# EAGLE schematic Esquematico_reservatorio (EAGLE 9.7.0)
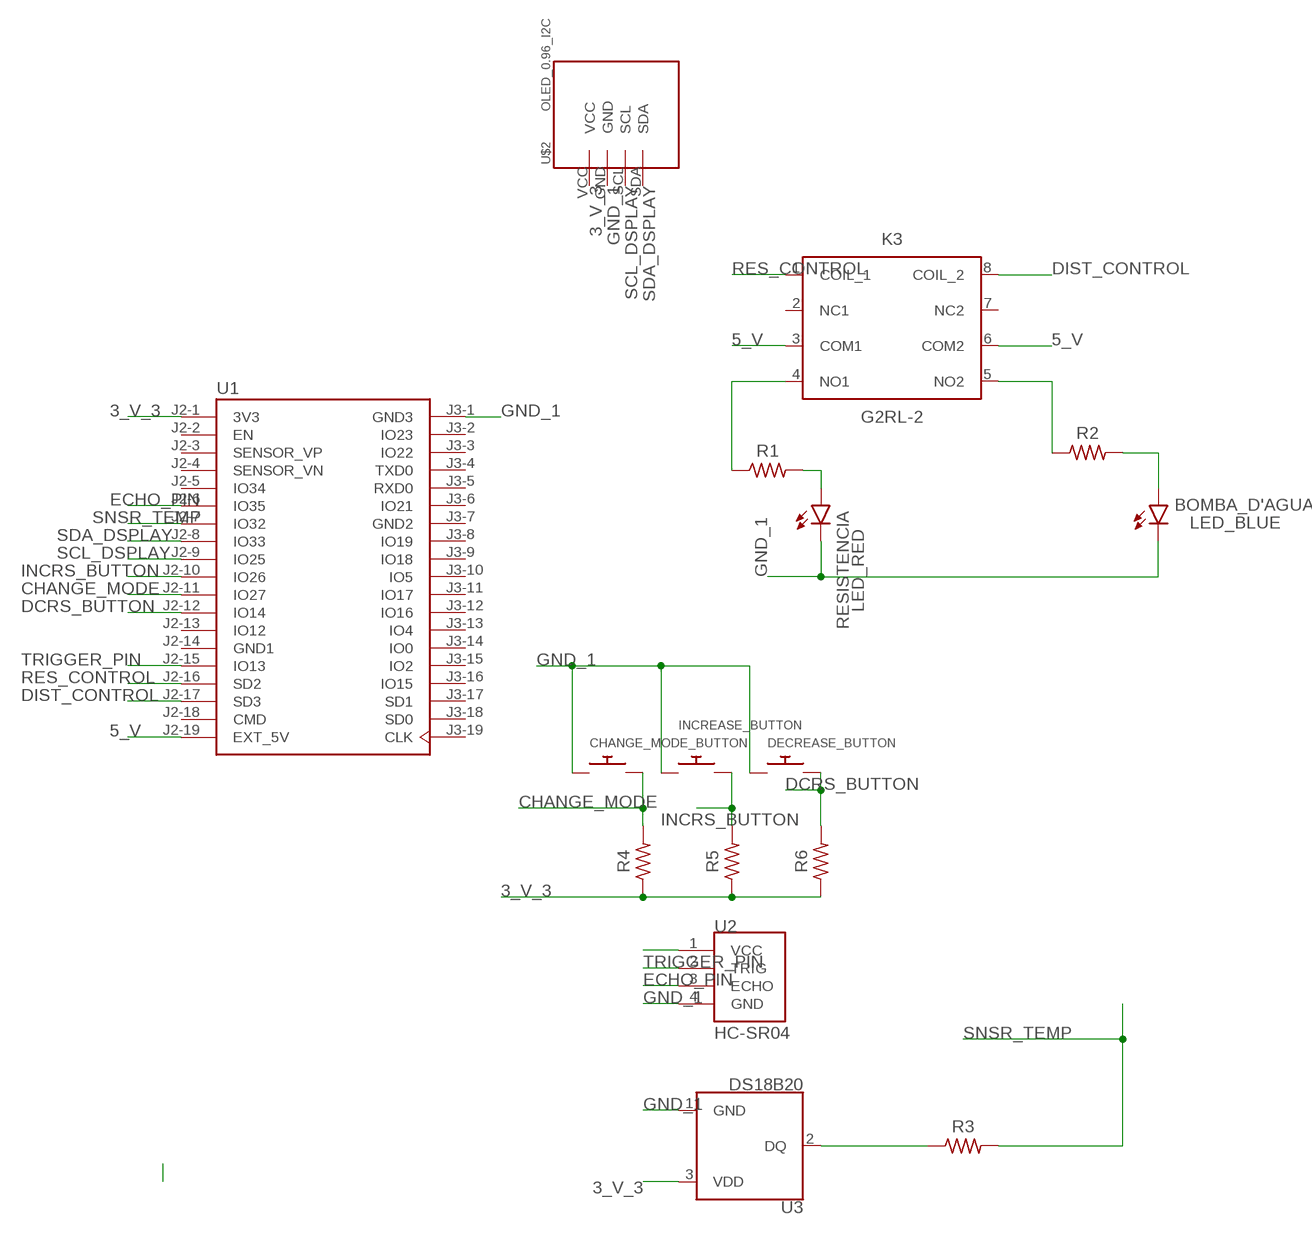
[diagram p0: schematic, sheet 1]

## Parts
BOMBA_D'AGUA  LED_BLUE  LED_RADIAL_BLUE  [LEDRD254W60D565H860B_B]
CHANGE_MODE_BUTTON  SWITCH_PUSHBUTTONC&K_KSS  [BTN_CK_KSS]
DECREASE_BUTTON  SWITCH_PUSHBUTTONC&K_KSS  [BTN_CK_KSS]
INCREASE_BUTTON  SWITCH_PUSHBUTTONC&K_KSS  [BTN_CK_KSS]
K3  G2RL-2  [G2RL-2]
R1  R-US_AXIAL-7.2MM-PITCH  [RESAD724W46L381D178B]
R2  R-US_AXIAL-7.2MM-PITCH  [RESAD724W46L381D178B]
R3  R-US_AXIAL-7.2MM-PITCH  [RESAD724W46L381D178B]
R4  R-US_AXIAL-7.2MM-PITCH  [RESAD724W46L381D178B]
R5  R-US_AXIAL-7.2MM-PITCH  [RESAD724W46L381D178B]
R6  R-US_AXIAL-7.2MM-PITCH  [RESAD724W46L381D178B]
RESISTENCIA  LED_RED  LED_RADIAL_RED  [LEDRD254W60D565H860B]
U1  ESP32-DEVKITC-32D  [MODULE_ESP32-DEVKITC-32D]
U2  HC-SR04  [XCVR_HC-SR04]
U3  DS18B20  [TO-92-TO92127P495H2044-3]
U$2  OLED_0.96_I2C  [OLED_0.96_I2C]

## Nets
3_V_3: U1.J2-1(3V3)
5_V: U1.J2-19(EXT_5V)
CHANGE_MODE: U1.J2-11(IO27)
DCRS_BUTTON: U1.J2-12(IO14)
DIST_CONTROL: U1.J2-17(SD3)
ECHO_PIN: U1.J2-6(IO35)
GND_1: U1.J3-1(GND3)
INCRS_BUTTON: U1.J2-10(IO26)
N$1: K3.1(COIL_1)
N$2: K3.8(COIL_2)
N$3: K3.3(COM1)
N$4: BOMBA_D'AGUA.1(A) R2.2
N$5: K3.6(COM2)
N$6: DECREASE_BUTTON.P$2 R6.2
N$7: K3.4(NO1) R1.1
N$8: INCREASE_BUTTON.P$2 R5.2
N$9: K3.5(NO2) R2.1
N$10: R4.1 R5.1 R6.1
N$11: R1.2 RESISTENCIA.1(A)
N$12: U3.1(GND)
N$14: BOMBA_D'AGUA.2(C) RESISTENCIA.2(C)
N$16: CHANGE_MODE_BUTTON.P$2 R4.2
N$17: R3.1 U3.2(DQ)
N$18: U3.3(VDD)
N$20: U2.1(VCC)
N$21: U2.2(TRIG)
N$23: CHANGE_MODE_BUTTON.P$1 DECREASE_BUTTON.P$1 INCREASE_BUTTON.P$1
N$24: U2.3(ECHO)
N$25: U2.4(GND)
N$27: R3.2
RES_CONTROL: U1.J2-16(SD2)
SCL_DSPLAY: U1.J2-9(IO25)
SDA_DSPLAY: U1.J2-8(IO33)
SNSR_TEMP: U1.J2-7(IO32)
TRIGGER_PIN: U1.J2-15(IO13)
Unconnected: K3.2(NC1) K3.7(NC2) U1.J2-2(EN) U1.J2-3(SENSOR_VP) U1.J2-4(SENSOR_VN) U1.J2-5(IO34) U1.J2-13(IO12) U1.J2-18(CMD) U1.J3-2(IO23) U1.J3-3(IO22) U1.J3-4(TXD0) U1.J3-5(RXD0) U1.J3-6(IO21) U1.J3-8(IO19) U1.J3-9(IO18) U1.J3-10(IO5) U1.J3-11(IO17) U1.J3-12(IO16) U1.J3-13(IO4) U1.J3-14(IO0) U1.J3-15(IO2) U1.J3-16(IO15) U1.J3-17(SD1) U1.J3-18(SD0) U1.J3-19(CLK) U$2.GND U$2.SCL U$2.SDA U$2.VCC

## Power pins joined to a net without a drawn wire
GND1: U1.J2-14(GND1)
GND2: U1.J3-7(GND2)

## Library data of the parts
BOMBA_D'AGUA RESISTENCIA = Atividade 3 Library:LED_RADIAL: LED - Generic; CATEGORY: Opto-Electronic; SUB-CATEGORY: LED
CHANGE_MODE_BUTTON DECREASE_BUTTON INCREASE_BUTTON = adafruit:SWITCH_PUSHBUTTON: Buttons SOFTTOUCHSMD_SJ - Soft touch temporary push button (Super Junk Akihabara) Compatible with SKPMANE010 [Mouser: 688-SKPMAN] C&K_KSS = Digikey: KSS221GLFS
K3 = Relay:G2RL-2: CONTACT TYPE : DPDT COIL RATING : 5 to 48 VDC Datasheet <https://omronfs.omron.com/en_US/ecb/products/pdf/en-g2rl.pdf>; CATEGORY: RELAY; MANUFACTURER: OMRON; OPERATING_TEMP: 40°C to 85°C; PART_STATUS: ACTIVE; ROHS_COMPLIANCE: ROHS COMPLIANT; SERIES: G2RL; SUB-CATEGORY: Power Relay; TYPE: DPDT
R1-R6 = Resistor:R-US: Resistor Fixed - ANSI; CATEGORY: Resistor; SUB-CATEGORY: Fixed
U1 = ESP32-DEVKITC-32D:ESP32-DEVKITC-32D: Check availability <https://pricing.snapeda.com/parts/ESP32-DEVKITC-32D/Espressif%20Systems/view-part?ref=eda>; AVAILABILITY: In Stock; DESCRIPTION: WiFi Development Tools (802.11) ESP32 General Development Kit, ESP32-WROOM-32D on the board; MF: Espressif Systems; MP: ESP32-DEVKITC-32D; PACKAGE: None; PRICE: None; PURCHASE-URL: https://pricing.snapeda.com/search?q=ESP32-DEVKITC-32D&ref=eda
U2 = HC-SR04:HC-SR04: Ultrasonic Sensor Module; MANUFACTURER: Osepp
U3 = DS18B20:DS18B20: digital thermometer -55C-125C TO92-3; MANUFACTURER: Maxim Integrated; PARTREV: 5; STANDARD: IPC-7251
U$2 = tft_1_8_1_44_oled_0_96:OLED_0.96_I2C